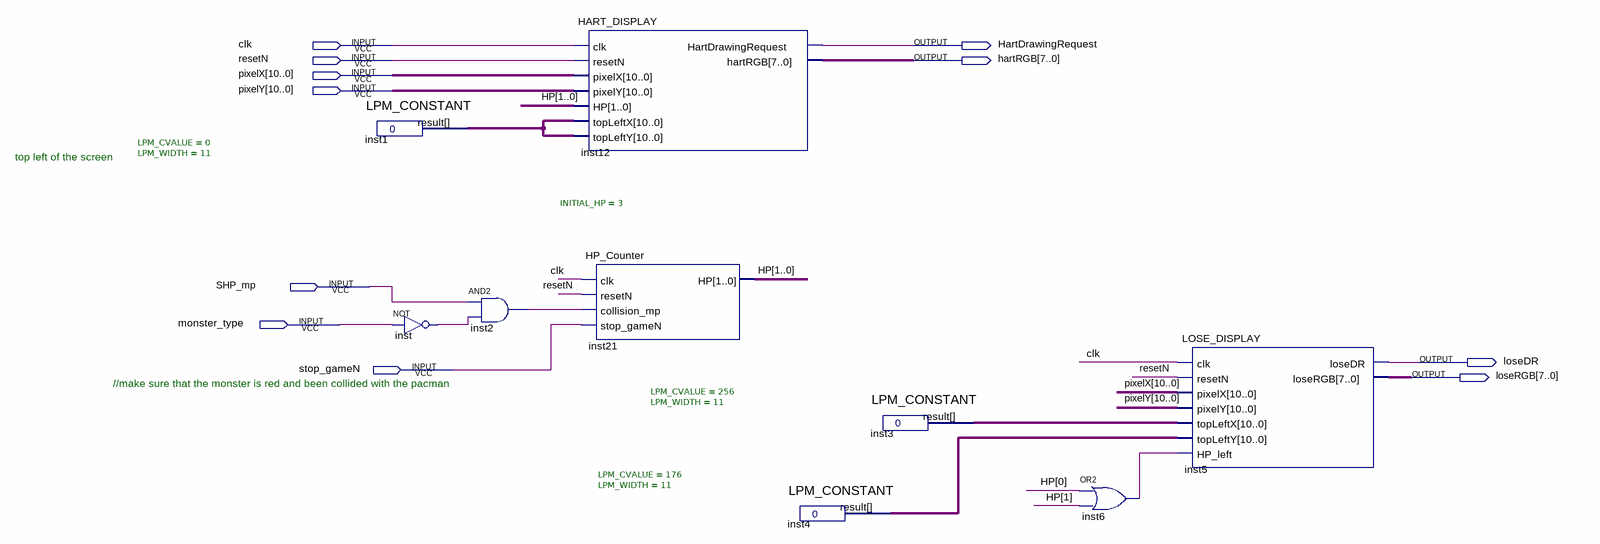
[diagram p0: schematic sheet]
// Quartus schematic HART_TOP.bdf as structural Verilog: 9 symbols, 11 pins
module HART_TOP (
  input  clk,
  input  resetN,
  input  [10:0] pixelX,
  input  [10:0] pixelY,
  input  SHP_mp,
  input  monster_type,
  input  stop_gameN,
  output HartDrawingRequest,
  output [7:0] hartRGB,
  output loseDR,
  output [7:0] loseRGB
);

  wire inst2_out, inst6_out, inst_out;
  wire [1:0] HP;
  wire [10:0] inst1_result, inst3_result, inst4_result;

  LPM_CONSTANT #(.LPM_CVALUE(0), .LPM_WIDTH(11)) inst1 (.result(inst1_result));
  not inst (inst_out, monster_type);
  and inst2 (inst2_out, SHP_mp, inst_out);
  HART_DISPLAY inst12 (
    .clk(clk), .resetN(resetN), .pixelX(pixelX), .pixelY(pixelY), .HP(HP), .topLeftX(inst1_result),
    .topLeftY(inst1_result), .HartDrawingRequest(HartDrawingRequest), .hartRGB(hartRGB));
  HP_Counter #(.INITIAL_HP(3)) inst21 (
    .clk(clk), .resetN(resetN), .collision_mp(inst2_out), .stop_gameN(stop_gameN), .HP(HP));
  LPM_CONSTANT #(.LPM_CVALUE(176), .LPM_WIDTH(11)) inst4 (.result(inst4_result));
  LPM_CONSTANT #(.LPM_CVALUE(256), .LPM_WIDTH(11)) inst3 (.result(inst3_result));
  or inst6 (inst6_out, HP[0], HP[1]);
  LOSE_DISPLAY inst5 (
    .clk(clk), .resetN(resetN), .pixelX(pixelX), .pixelY(pixelY), .topLeftX(inst3_result),
    .topLeftY(inst4_result), .HP_left(inst6_out), .loseDR(loseDR), .loseRGB(loseRGB));

  // Notes on the sheet:
  //   top left of the screen
  //   //make sure that the monster is red and been collided with the pacman
endmodule
